# Altium schematic sheet Output_For_Relay.SchDoc
size A; SheetNumber: 6; SheetTotal: 8
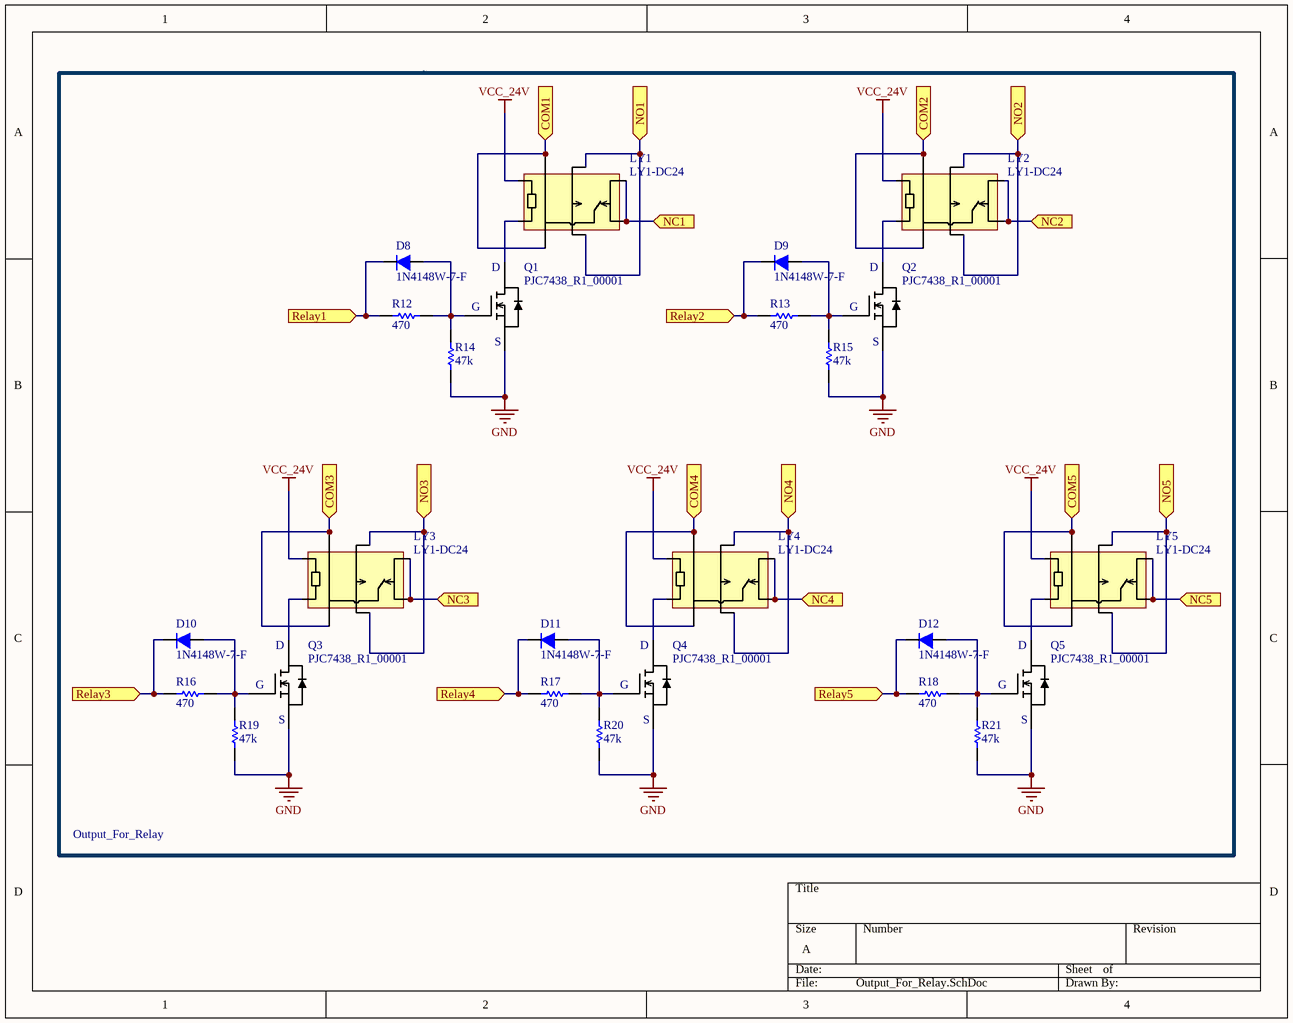
[diagram p0: Output_For_Relay.SchDoc]

## Parts
D8  1N4148W-7-F  [1N4148]
D9  1N4148W-7-F  [1N4148]
D10  1N4148W-7-F  [1N4148]
D11  1N4148W-7-F  [1N4148]
D12  1N4148W-7-F  [1N4148]
LY1  LY1-DC24  [LY1-DC24]
LY2  LY1-DC24  [LY1-DC24]
LY3  LY1-DC24  [LY1-DC24]
LY4  LY1-DC24  [LY1-DC24]
LY5  LY1-DC24  [LY1-DC24]
Q1  PJC7438_R1_00001  [PJC7438]
Q2  PJC7438_R1_00001  [PJC7438]
Q3  PJC7438_R1_00001  [PJC7438]
Q4  PJC7438_R1_00001  [PJC7438]
Q5  PJC7438_R1_00001  [PJC7438]
R12  value 470  [RES-SM-0603]  (hidden comment: ESR03EZPJ471)
R13  value 470  [RES-SM-0603]  (hidden comment: ESR03EZPJ471)
R14  value 47k  [RES-SM-0603]  (hidden comment: ESR03EZPJ473)
R15  value 47k  [RES-SM-0603]  (hidden comment: ESR03EZPJ473)
R16  value 470  [RES-SM-0603]  (hidden comment: ESR03EZPJ471)
R17  value 470  [RES-SM-0603]  (hidden comment: ESR03EZPJ471)
R18  value 470  [RES-SM-0603]  (hidden comment: ESR03EZPJ471)
R19  value 47k  [RES-SM-0603]  (hidden comment: ESR03EZPJ473)
R20  value 47k  [RES-SM-0603]  (hidden comment: ESR03EZPJ473)
R21  value 47k  [RES-SM-0603]  (hidden comment: ESR03EZPJ473)

## Blocks framed on the sheet
Output_For_Relay: D8-D12 LY1-LY5 Q1-Q5 R12-R21

## Ports
COM1 (in), COM2 (in), COM3 (in), COM4 (in), COM5 (in), NC1 (in), NC2 (in), NC3 (in), NC4 (in), NC5 (in), NO1 (in), NO2 (in), NO3 (in), NO4 (in), NO5 (in), Relay1 (in), Relay2 (in), Relay3 (in), Relay4 (in), Relay5 (in)

## Nets
GND: Q1.2(S) Q2.2(S) Q3.2(S) Q4.2(S) Q5.2(S) R14.2 R15.2 R19.2 R20.2 R21.2
VCC_24V: LY1.7 LY2.7 LY3.7 LY4.7 LY5.7
COM1: LY1.5 LY1.6 ; port COM1
COM2: LY2.5 LY2.6 ; port COM2
COM3: LY3.5 LY3.6 ; port COM3
COM4: LY4.5 LY4.6 ; port COM4
COM5: LY5.5 LY5.6 ; port COM5
NC1: LY1.1 LY1.2 ; port NC1
NC2: LY2.1 LY2.2 ; port NC2
NC3: LY3.1 LY3.2 ; port NC3
NC4: LY4.1 LY4.2 ; port NC4
NC5: LY5.1 LY5.2 ; port NC5
NO1: LY1.3 LY1.4 ; port NO1
NO2: LY2.3 LY2.4 ; port NO2
NO3: LY3.3 LY3.4 ; port NO3
NO4: LY4.3 LY4.4 ; port NO4
NO5: LY5.3 LY5.4 ; port NO5
Relay1: D8.2(K) R12.2 ; port Relay1
Relay2: D9.2(K) R13.2 ; port Relay2
Relay3: D10.2(K) R16.2 ; port Relay3
Relay4: D11.2(K) R17.2 ; port Relay4
Relay5: D12.2(K) R18.2 ; port Relay5
NetD8_1: D8.1(A) Q1.1(G) R12.1 R14.1
NetD9_1: D9.1(A) Q2.1(G) R13.1 R15.1
NetD10_1: D10.1(A) Q3.1(G) R16.1 R19.1
NetD11_1: D11.1(A) Q4.1(G) R17.1 R20.1
NetD12_1: D12.1(A) Q5.1(G) R18.1 R21.1
NetLY1_8: LY1.8 Q1.3(D)
NetLY2_8: LY2.8 Q2.3(D)
NetLY3_8: LY3.8 Q3.3(D)
NetLY4_8: LY4.8 Q4.3(D)
NetLY5_8: LY5.8 Q5.3(D)

## Library data of the parts
D8-D12 = 1N4148: Diode Standard 100 V 300mA (DC) Surface Mount SOD-123; Mfr: Diodes Incorporated; Voltage - DC Reverse (Vr) (Max): 100 V; Voltage - Forward (Vf) (Max) @ If: 1.25 V @ 150 mA; Speed: Small Signal =< 200mA (Io), Any Speed; Reverse Recovery Time (trr): 4 ns; Current - Reverse Leakage @ Vr: 1 µA @ 100 V; Capacitance @ Vr, F: 2pF @ 0V, 1MHz; No. Pad (SMD): 2; No. Pad (THT): 0; ComponentLink1Description: New link; ComponentLink1URL: https://www.digikey.com/en/products/detail/diodes-incorporated/1N4148W-7-F/814371; Diode Type: Standard; Current - Average Rectified (Io): 300mA (DC); Mounting Type: Surface Mount; Unit Price (Digikey): 0.18
LY1-LY5 = LY1-DC24: General Purpose Relay SPDT (1 Form C) 24VDC Coil Socketable; Mfr: Omron Automation and Safety; Contact Rating (Current): 15 A; Switching Voltage: 250VAC, 125VDC - Max; Coil Current: 36.9 mA; Coil Type: Non Latching; Must Operate Voltage: 19.2 VDC; Must Release Voltage: 2.4 VDC; Operate Time: 25 ms; Coil Resistance: 650 Ohms; No. Pad (SMD): 0; No. Pad (THT): 8; ComponentLink1URL: https://www.digikey.com/en/products/detail/omron-automation-and-safety/LY1-DC24/126843?s=N4IgTCBcDaIDIE0CMBaAIgYTAFhAXQF8g; Mounting Type: Socketable; Coil Voltage: 24VDC; Contact Form: SPDT (1 Form C); Termination Style: Plug In; Release Time: 25 ms; Operating Temperature: -25°C ~ 55°C; Unit Price (Digikey): 11.86
  LY1: ComponentLink1Description: Digikey
  LY2-LY5: ComponentLink1Description: New link
Q1-Q5 = PJC7438: N-Channel 50 V 400mA (Ta) 350mW (Ta) Surface Mount SOT-323; Mfr: Panjit International Inc.; Drain to Source Voltage (Vdss): 50 V; Drive Voltage (Max Rds On, Min Rds On): 1.8V, 10V; Rds On (Max) @ Id, Vgs: 1.45Ohm @ 500mA, 10V; Vgs(th) (Max) @ Id: 1V @ 250µA; Gate Charge (Qg) (Max) @ Vgs: 0.95 nC @ 4.5 V; Vgs (Max): ±20V; Input Capacitance (Ciss) (Max) @ Vds: 36 pF @ 25 V; No. Pad (SMD): 3; No. Pad (THT): 0; ComponentLink1Description: New link; ComponentLink1URL: https://www.panjit.com.tw/upload/datasheet/PJC7438.pdf; FET Type: N-Channel; Technology: MOSFET (Metal Oxide); Current - Continuous Drain (Id) @ 25°C: 400mA (Ta); Power Dissipation (Max): 350mW (Ta); Operating Temperature: -55°C ~ 150°C (TJ); Mounting Type: Surface Mount; Package / Case: SC-70, SOT-323; Unit Price (Digikey): 0.47
R12 R13 R16-R18 = RESISTOR SMD: RES SMD 470 OHM 5% 1/4W 0603; Mfr: Rohm Semiconductor; Resistance: 470 Ohms; Power (Watts): 0.25W, 1/4W; Temperature Coefficient: ±200ppm/°C; No. Pad (SMD): 2; No. Pad (THT): 0; Category: Resistors; Series: ESR; Tolerance: ±5%; Composition: Thick Film; Features: Automotive AEC-Q200, Pulse Withstanding; Operating Temperature: -55°C ~ 155°C; Package / Case: 0603 (1608 Metric); Supplier Device Package: 0603; Ratings: AEC-Q200; Size / Dimension: 0.063" L x 0.031" W (1.60mm x 0.80mm); Height - Seated (Max): 0.022" (0.55mm); Number of Terminations: 2; Unit Price (Digikey): 0.14
R14 R15 R19-R21 = RESISTOR SMD: RES SMD 47K OHM 5% 1/4W 0603; Mfr: Rohm Semiconductor; Resistance: 47 kOhms; Power (Watts): 0.25W, 1/4W; Temperature Coefficient: ±200ppm/°C; No. Pad (SMD): 2; No. Pad (THT): 0; Category: Resistors; Series: ESR; Tolerance: ±5%; Composition: Thick Film; Features: Automotive AEC-Q200, Pulse Withstanding; Operating Temperature: -55°C ~ 155°C; Package / Case: 0603 (1608 Metric); Supplier Device Package: 0603; Ratings: AEC-Q200; Size / Dimension: 0.063" L x 0.031" W (1.60mm x 0.80mm); Height - Seated (Max): 0.022" (0.55mm); Number of Terminations: 2; Unit Price (Digikey): 0.14
  R15: ComponentLink1Description: New link; ComponentLink1URL: *